# EAGLE design Knob_8266 (EAGLE 6.6.0)
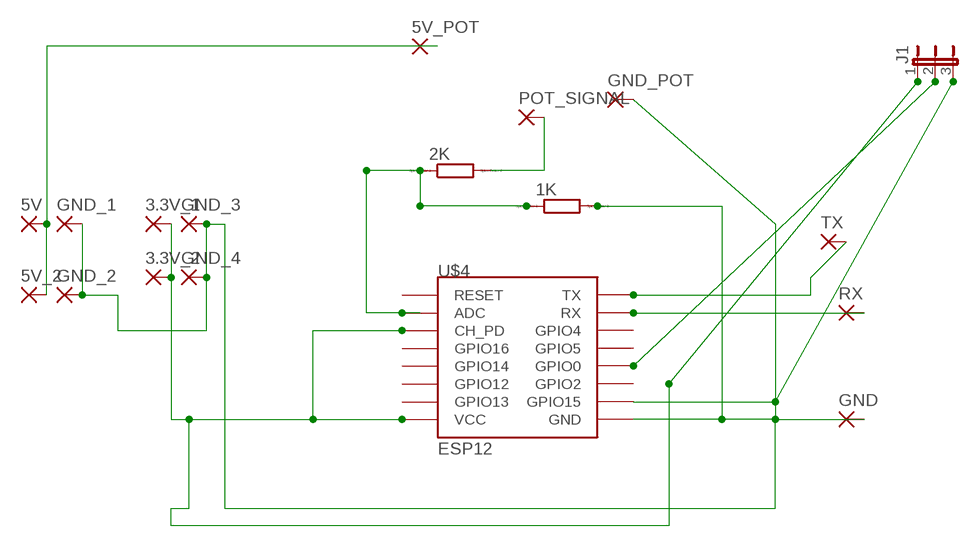
[diagram p0: schematic, sheet 1]

## Parts
1K  R0204/7  [0204/7]
2K  R0204/7  [0204/7]
3.3V_1  2,15/1,0  [2,15/1,0]
3.3V_2  2,15/1,0  [2,15/1,0]
5V  2,15/1,0  [2,15/1,0]
5V_2  2,15/1,0  [2,15/1,0]
5V_POT  2,15/1,0  [2,15/1,0]
GND  2,15/1,0  [2,15/1,0]
GND_1  2,15/1,0  [2,15/1,0]
GND_2  2,15/1,0  [2,15/1,0]
GND_3  2,15/1,0  [2,15/1,0]
GND_4  2,15/1,0  [2,15/1,0]
GND_POT  2,15/1,0  [2,15/1,0]
J1  JP2E  [JP2]
POT_SIGNAL  2,15/1,0  [2,15/1,0]
RX  2,15/1,0  [2,15/1,0]
TX  2,15/1,0  [2,15/1,0]
U$4  ESP12  [ESP12]

## Nets
5V: 1K.2 5V.1(P) 5V_2.1(P) 5V_POT.1(P) GND.1(P) GND_1.1(P) GND_2.1(P) GND_3.1(P) GND_4.1(P) GND_POT.1(P) J1.3 U$4.GND U$4.GPIO15
N$1: J1.2 U$4.GPIO0
N$2: 1K.1 2K.1 U$4.ADC
N$3: 2K.2 POT_SIGNAL.1(P)
N$5: 3.3V_1.1(P) 3.3V_2.1(P) J1.1 U$4.CH_PD U$4.VCC
RX: RX.1(P) U$4.RX
TX: TX.1(P) U$4.TX
Unconnected: U$4.GPIO2 U$4.GPIO4 U$4.GPIO5 U$4.GPIO12 U$4.GPIO13 U$4.GPIO14 U$4.GPIO16 U$4.RESET

## Library data of the parts
1K 2K = eagle-ltspice:R: RESISTOR, European symbol; SPICEMODEL: NONE; SPICEPREFIX: R
3.3V_1 3.3V_2 5V 5V_2 5V_POT GND GND_1-GND_4 GND_POT POT_SIGNAL RX TX = wirepad:2,15/1,0: THROUGH-HOLE PAD
J1 = jumper:JP2E: JUMPER
U$4 = esp8266modules:ESP12: ESP8266 Wifi module 12

## Board
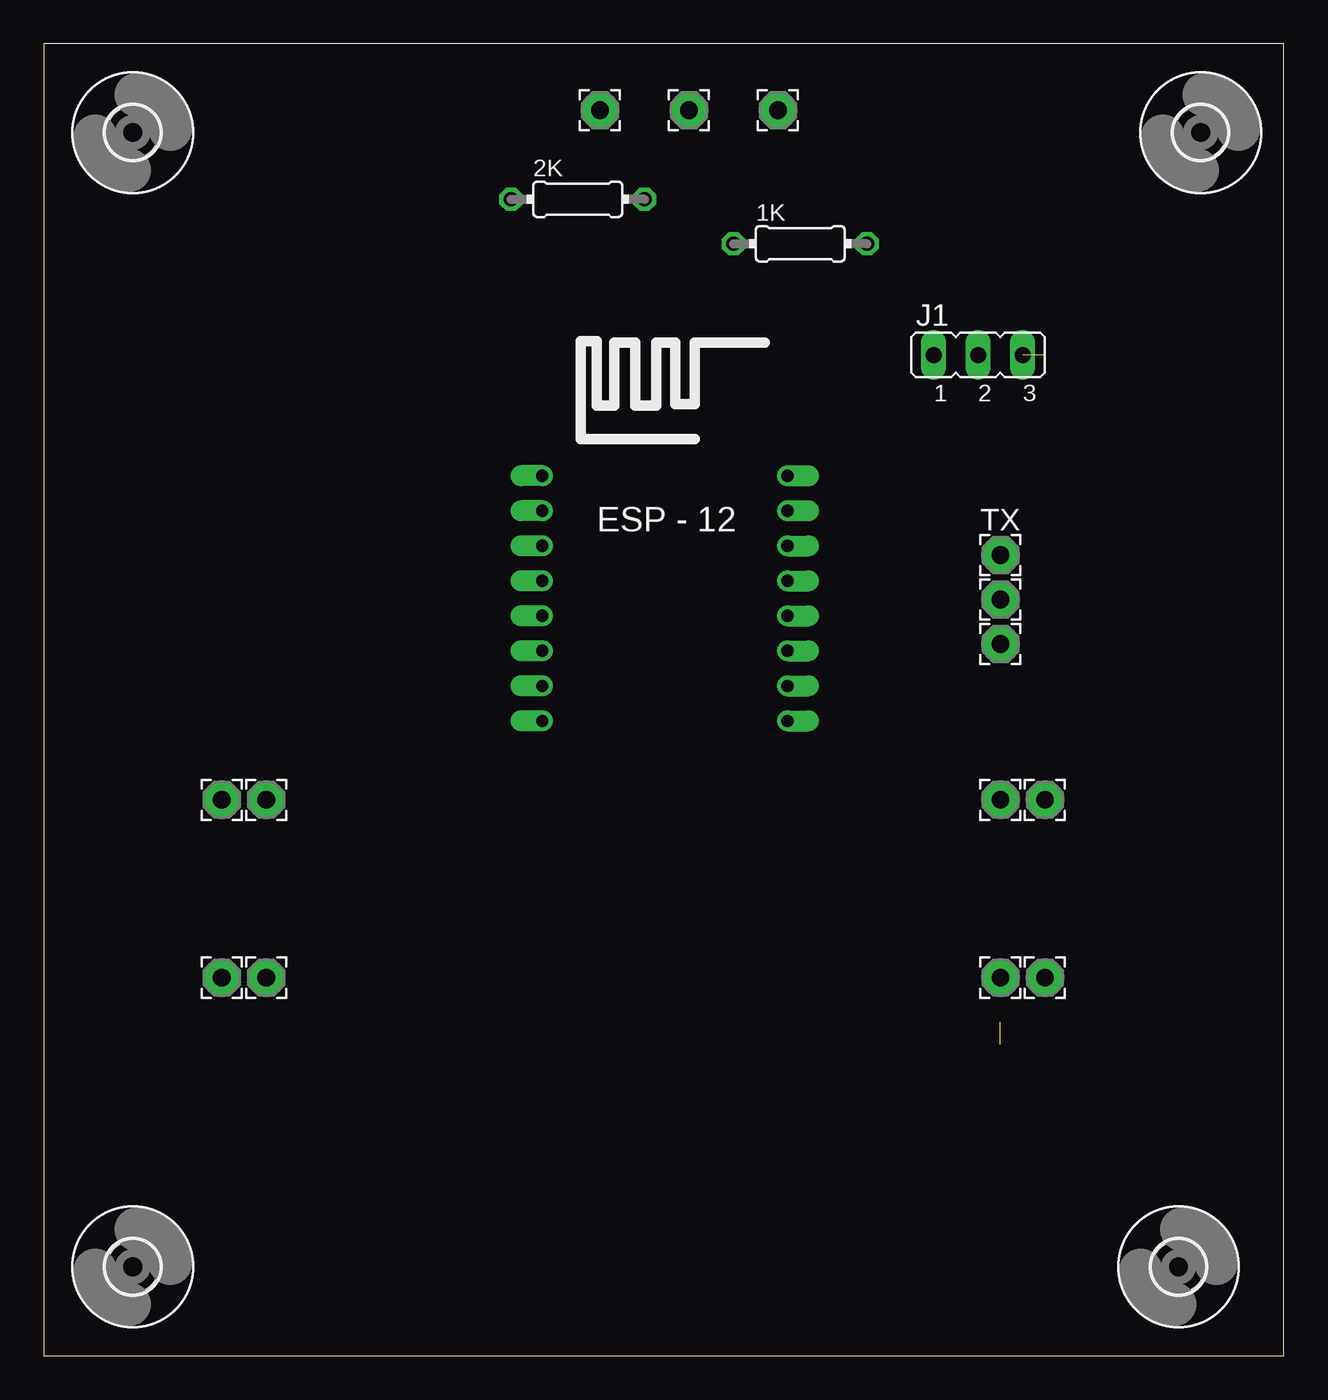
[diagram p1: board, top side]
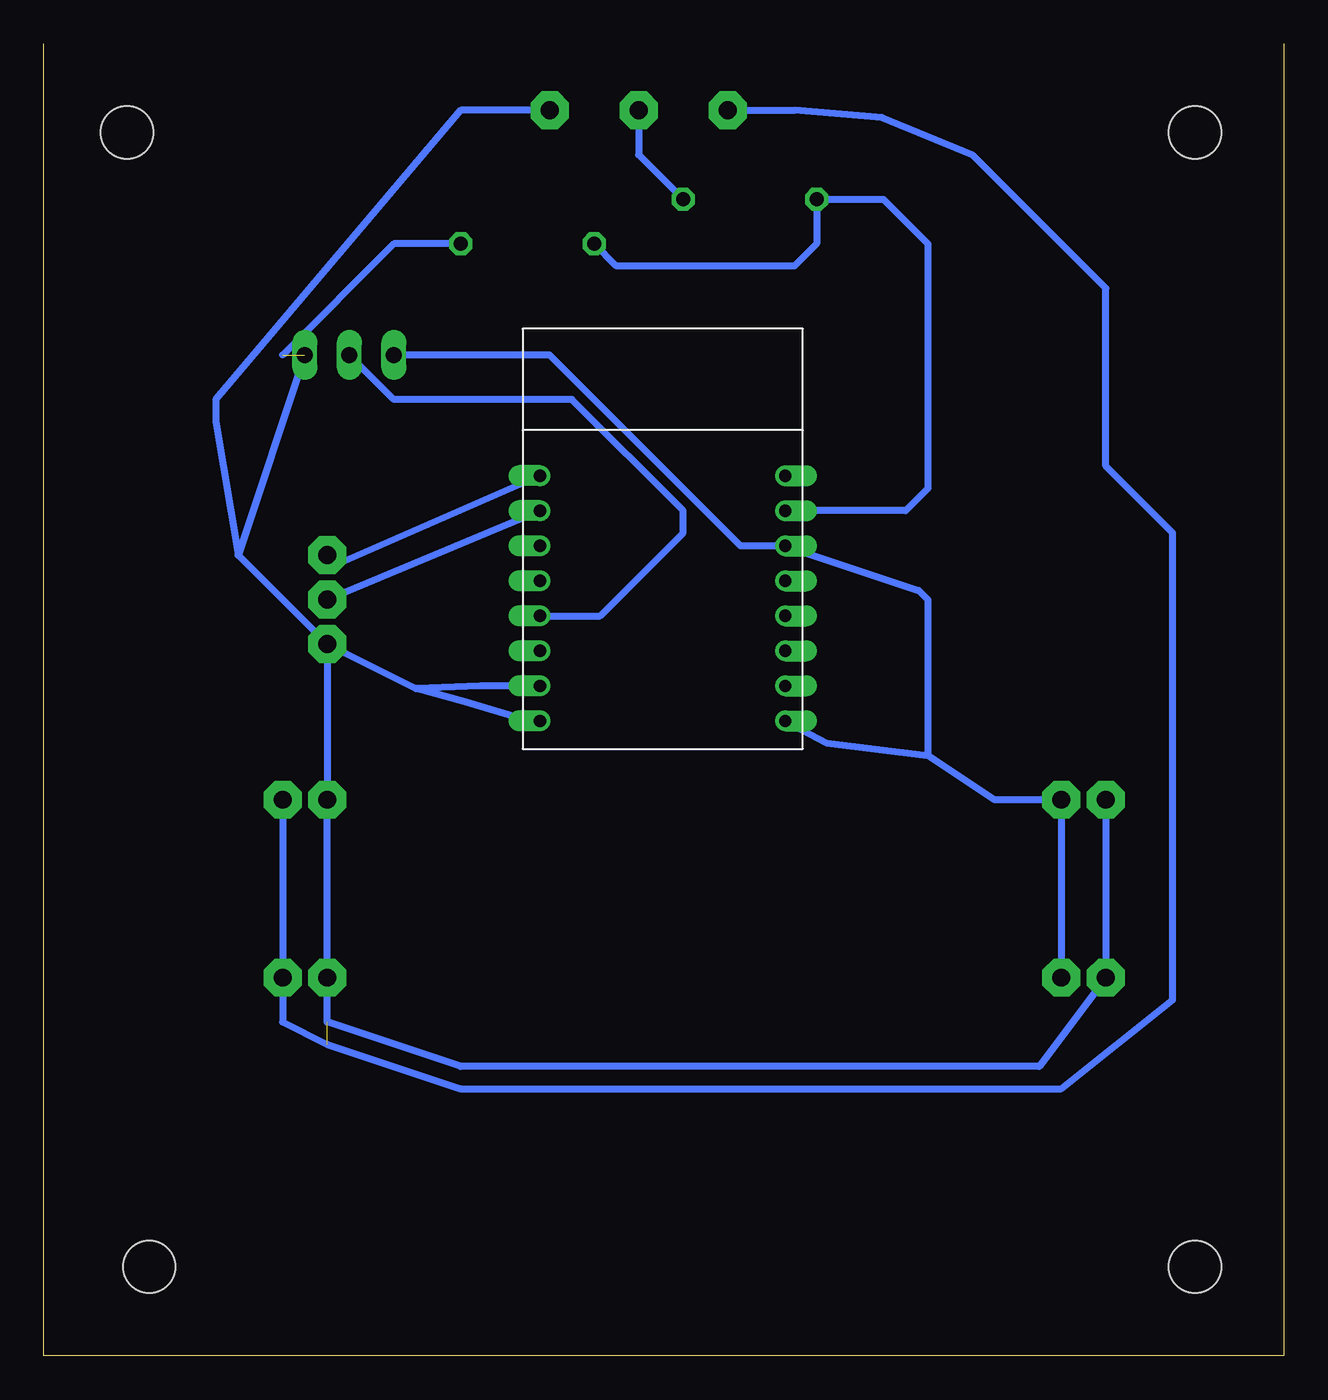
[diagram p2: board, bottom side, seen from below]

Size 70.79 x 74.92 mm. Coordinates in mm from the lower left corner, seen from the top.
Outline: 70.79,74.92 70.79,0 0,0 0,74.92
Copper layers (1*16): Top 0.035mm / dielectric 1.5mm / Bottom 0.035mm
Design rules "default *": minimum track width 10mil, minimum drill 13mil, track to track 8mil, track to pad 8mil, pad to pad 8mil, via to via 8mil, smd to smd 8mil, copper to edge 40mil, drill to drill 8mil, minimum pad ring 10mil, minimum via ring 8mil, stop-mask expansion 4mil, vias tented up to drill 0mil, thermal gap 10mil

### Footprints (pad centres in the part's own frame; a part is rotated, then mirrored left to right if it is on the bottom)
0204/7 = drill 0.813 octagon: 1 -3.81,0; 2 3.81,0
2,15/1,0 = drill 1.016 pad 2.159 octagon: 1 0,0
JP2 = drill 0.914 long: 1 -2.54,0; 2 0,0; 3 2.54,0
3,0 = hole 3: 0,0
ESP12 = drill 0.7 offset: ADC -7.1,3.8; CH_PD -7.1,1.8; GND 6.9,-8.2; GPIO0 6.9,-2.2; GPIO2 6.9,-4.2; GPIO4 6.9,1.8; GPIO5 6.9,-0.2; GPIO12 -7.1,-4.2; GPIO13 -7.1,-6.2; GPIO14 -7.1,-2.2; GPIO15 6.9,-6.2; GPIO16 -7.1,-0.2; RESET -7.1,5.8; RX 6.9,3.8; TX 6.9,5.8; VCC -7.1,-8.2

### Placement (x,y rotation side)
1K  43.18,63.5 0 top
2K  30.48,66.04 0 top
3.3V_1  12.7,21.59 0 top
3.3V_2  12.7,31.75 0 top
5V  57.15,31.75 0 top
5V_2  57.15,21.59 0 top
5V_POT  31.75,71.12 0 top
GND  54.61,31.75 0 top
GND_1  54.61,21.59 0 top
GND_2  10.16,21.59 0 top
GND_3  54.61,40.64 0 top
GND_4  10.16,31.75 0 top
GND_POT  41.91,71.12 0 top
J1  53.34,57.15 0 top
POT_SIGNAL  36.83,71.12 0 top
RX  54.61,43.18 0 top
TX  54.61,45.72 0 top
U$1  [3,0]  5.08,69.85 0 top
U$2  [3,0]  5.08,5.08 0 top
U$4  35.56,44.45 0 top
U$5  [3,0]  64.77,5.08 0 top
U$6  [3,0]  66.04,69.85 0 top

### Tracks (layer width: path | path; a pad name or v marks a point on that pad's centre or on a via)
5V  (2 unrouted)
  Bottom 0.406: J1.3 59.69,45.72 | 59.69,45.72 GND_3.1 | GND_3.1 GND.1 GND_1.1 54.61,19.05 46.99,16.51 13.97,16.51 GND_2.1 GND_4.1 | GND_3.1 49.53,38.1 | 49.53,38.1 46.74,37.34 43.11,36.25 U$4.GND | U$4.GPIO15 45.87,38.25 49.53,38.1 | 59.69,45.72 60.96,53.34 60.96,54.61 46.99,71.12 GND_POT.1 | 5V.1 5V_2.1 57.15,19.05 54.61,17.78 46.99,15.24 12.7,15.24 6.35,20.32 6.35,46.99 10.16,50.8 10.16,60.96 17.78,68.58 22.93,70.71 27.94,71.12 5V_POT.1 | 1K.2 50.8,63.5 57.15,57.15
N$1
  Bottom 0.406: U$4.GPIO0 39.03,42.25 34.29,46.99 34.29,48.26 40.64,54.61 50.8,54.61 J1.2
N$2
  Bottom 0.406: U$4.ADC 21.59,48.26 20.32,49.53 20.32,63.5 22.86,66.04 2K.1 26.67,63.5 27.94,62.23 38.1,62.23 1K.1
N$3
  Bottom 0.406: POT_SIGNAL.1 36.83,68.58 2K.2
N$5
  Bottom 0.406: 20.32,34.29 20.32,43.18 20.85,43.71 U$4.CH_PD 31.01,46.25 41.91,57.15 J1.1 | 3.3V_1.1 3.3V_2.1 16.51,31.75 20.32,34.29 | U$4.VCC 26.09,34.98 20.32,34.29
RX
  Bottom 0.406: U$4.RX RX.1
TX
  Bottom 0.406: U$4.TX 54.06,45.17 TX.1